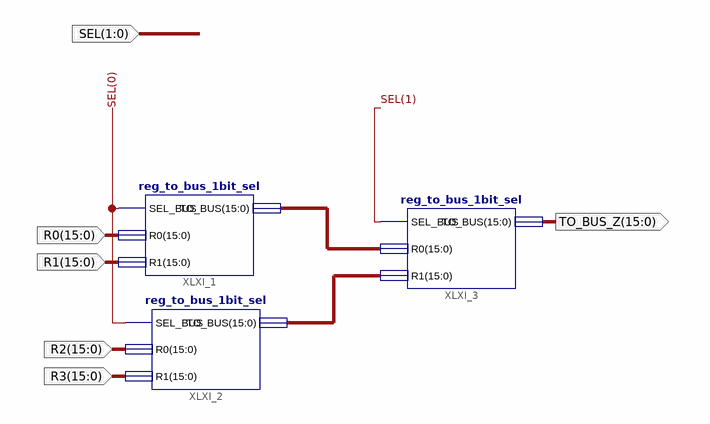
[diagram p0: schematic sheet 1]
// Xilinx ISE schematic reg_to_bus_2bit_sel.sch (artix7) as structural Verilog: 3 symbols, 6 ports
module reg_to_bus_2bit_sel (
  input  [15:0] R1,
  input  [15:0] R0,
  input  [15:0] R2,
  input  [15:0] R3,
  input  [1:0] SEL,
  output [15:0] TO_BUS_Z
);

  wire [15:0] XLXN_5, XLXN_6;

  reg_to_bus_1bit_sel XLXI_1 (.SEL_BUS(SEL[0]), .R0(R0), .R1(R1), .TO_BUS(XLXN_5));
  reg_to_bus_1bit_sel XLXI_2 (.SEL_BUS(SEL[0]), .R0(R2), .R1(R3), .TO_BUS(XLXN_6));
  reg_to_bus_1bit_sel XLXI_3 (.SEL_BUS(SEL[1]), .R0(XLXN_5), .R1(XLXN_6), .TO_BUS(TO_BUS_Z));
endmodule
